# EAGLE schematic radar (EAGLE 7.1.0)
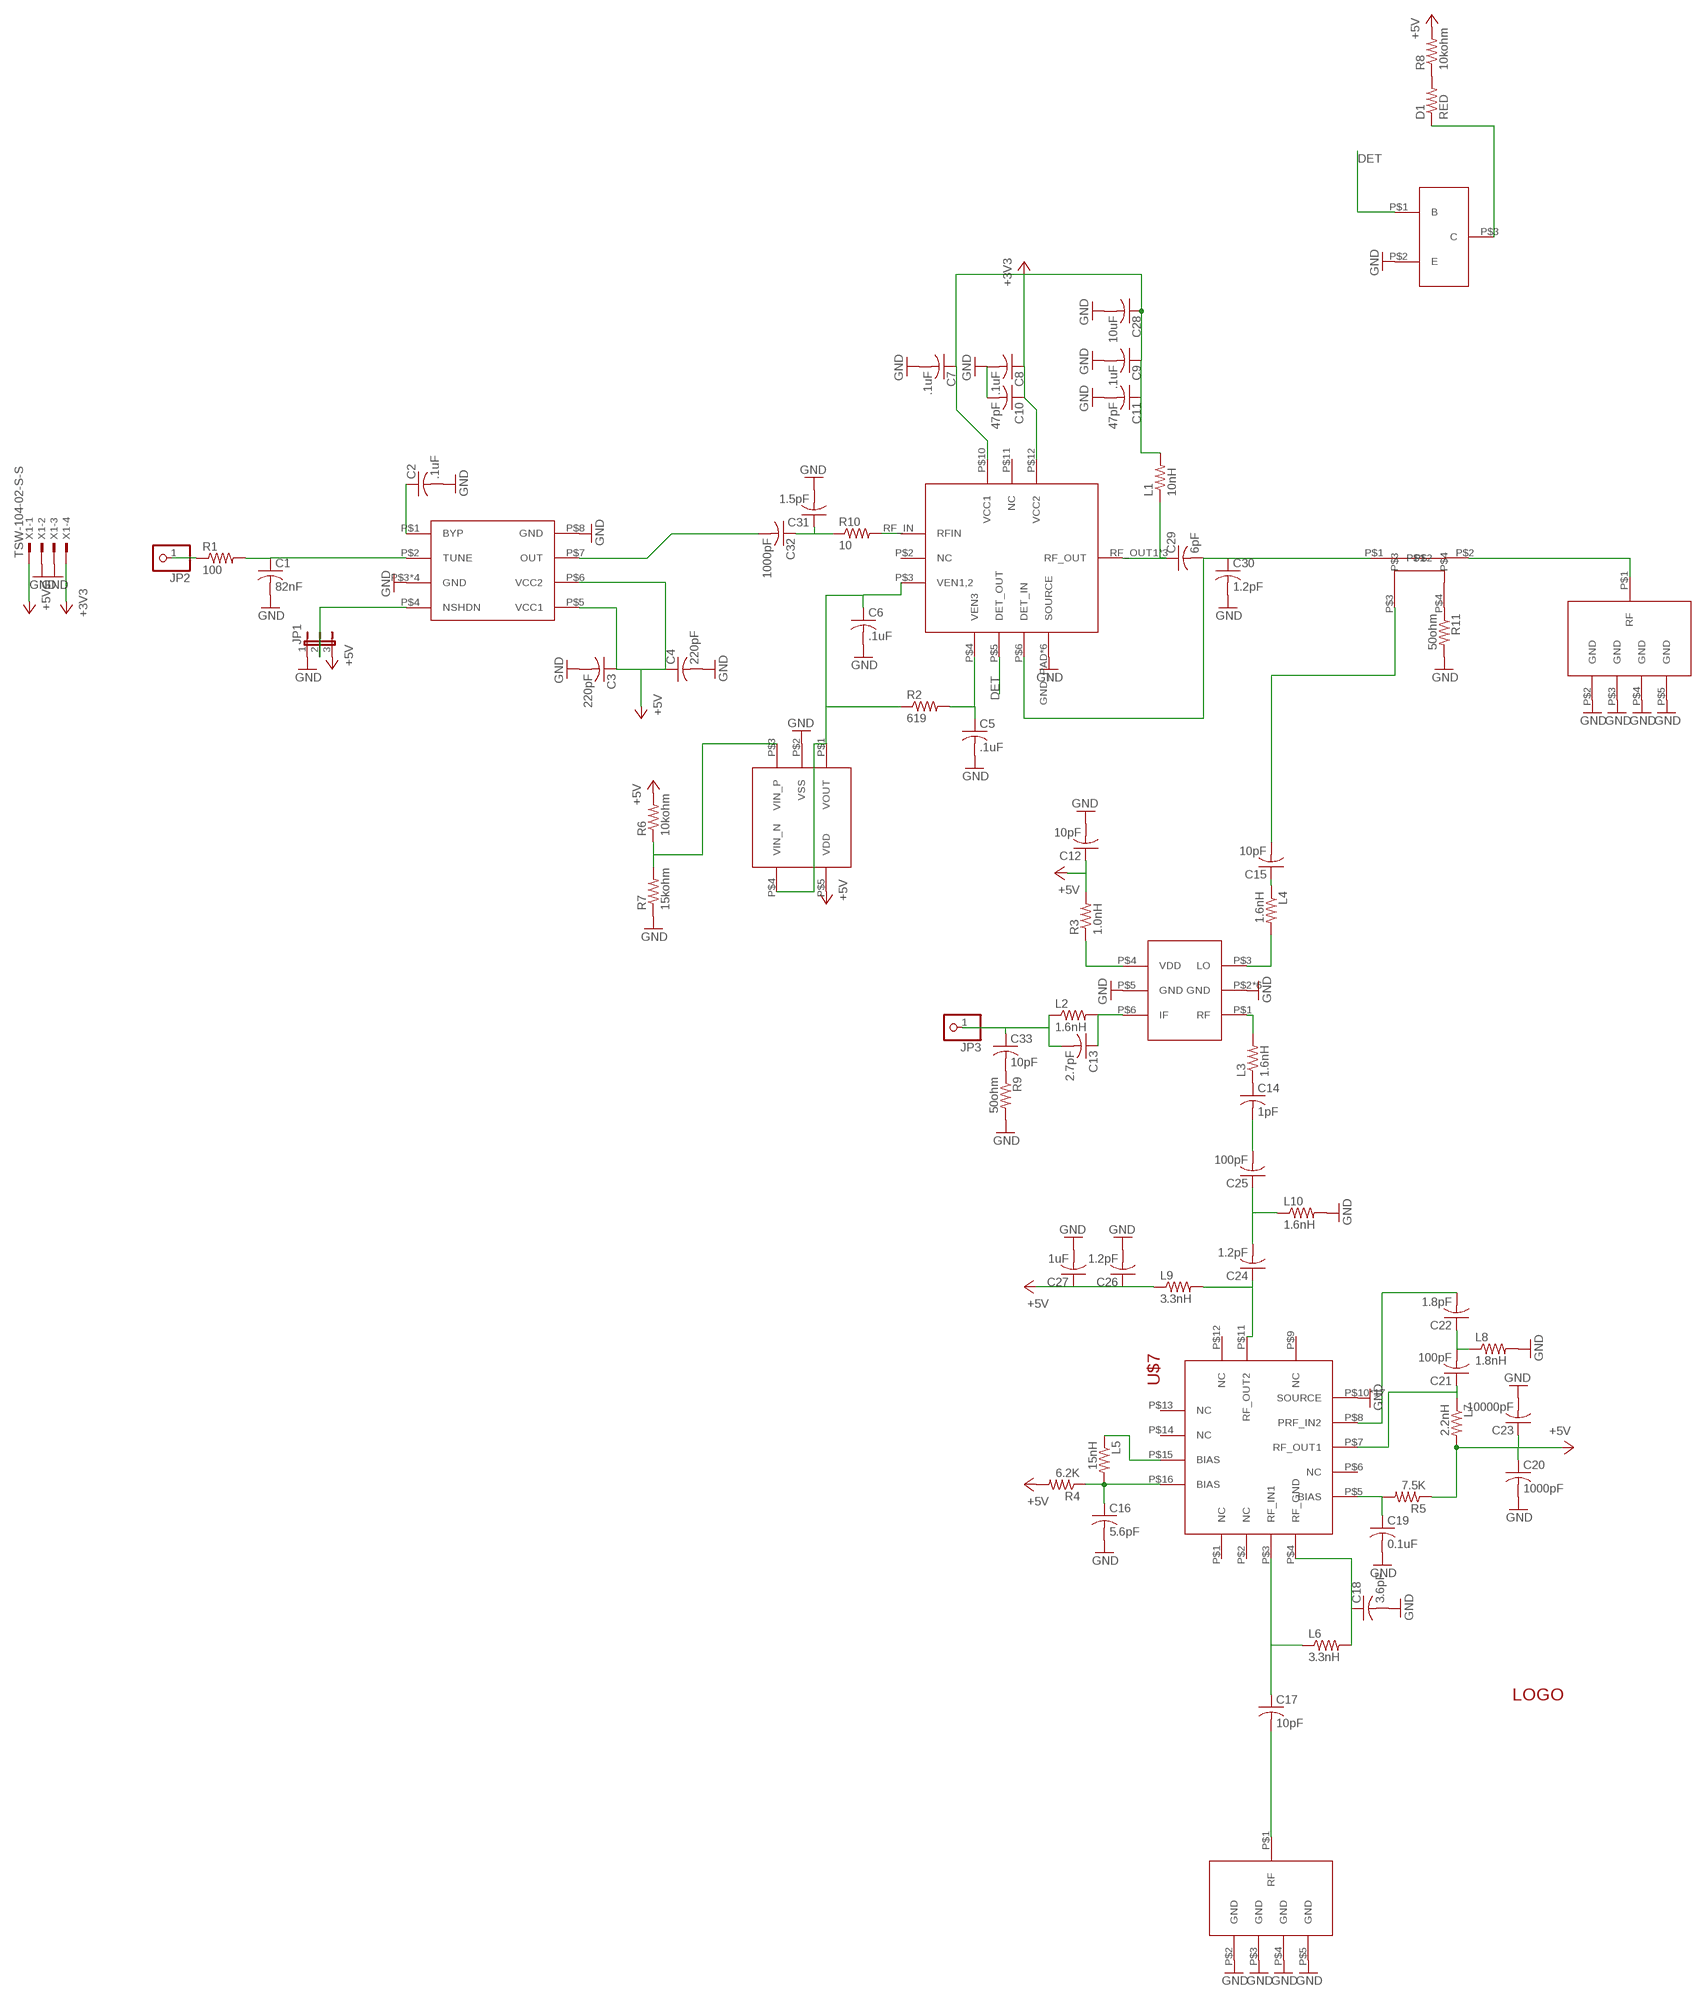
[diagram p0: schematic, sheet 1]

## Parts
C1  82nF  C-USC3216  [C3216]
C2  .1uF  C-USC0805  [C0805]
C3  220pF  C-USC0805  [C0805]
C4  220pF  C-USC0805  [C0805]
C5  .1uF  C-USC0805  [C0805]
C6  .1uF  C-USC0805  [C0805]
C7  .1uF  C-USC0805  [C0805]
C8  .1uF  C-USC0805  [C0805]
C9  .1uF  C-USC0805  [C0805]
C10  47pF  C-USC0805  [C0805]
C11  47pF  C-USC0805  [C0805]
C12  10pF  C-USC0805  [C0805]
C13  2.7pF  C-USC0603  [C0603]
C14  1pF  C-USC0603  [C0603]
C15  10pF  C-USC0603  [C0603]
C16  5.6pF  C-USC0603  [C0603]
C17  10pF  C-USC0603  [C0603]
C18  3.6pF  C-USC0603  [C0603]
C19  0.1uF  C-USC0603  [C0603]
C20  1000pF  C-USC0603  [C0603]
C21  100pF  C-USC0603  [C0603]
C22  1.8pF  C-USC0603  [C0603]
C23  10000pF  C-USC0603  [C0603]
C24  1.2pF  C-USC0603  [C0603]
C25  100pF  C-USC0603  [C0603]
C26  1.2pF  C-USC0603  [C0603]
C27  1uF  C-USC0603  [C0603]
C28  10uF  C-USC1206  [C1206]
C29  6pF  C-USC0603  [C0603]
C30  1.2pF  C-USC0603  [C0603]
C31  1.5pF  C-USC0603K  [C0603K]
C32  1000pF  C-USC0603K  [C0603K]
C33  10pF  C-USC0805  [C0805]
D1  RED  R-US_R1206  [R1206]
JP1  JP2E  [JP2]
JP2  PINHD-1X1  [1X01]
JP3  PINHD-1X1  [1X01]
L1  10nH  R-US_R0603  [R0603]
L2  1.6nH  R-US_R0603  [R0603]
L3  1.6nH  R-US_R0603  [R0603]
L4  1.6nH  R-US_R0603  [R0603]
L5  15nH  R-US_R0603  [R0603]
L6  3.3nH  R-US_R0603  [R0603]
L7  2.2nH  R-US_R0603  [R0603]
L8  1.8nH  R-US_R0603  [R0603]
L9  3.3nH  R-US_R0603  [R0603]
L10  1.6nH  R-US_R0603  [R0603]
R1  100  R-US_R1206  [R1206]
R2  619  R-US_R0805  [R0805]
R3  1.0nH  R-US_R0402  [R0402]
R4  6.2K  R-US_R0603  [R0603]
R5  7.5K  R-US_R0603  [R0603]
R6  10kohm  R-US_R1206  [R1206]
R7  15kohm  R-US_R1206  [R1206]
R8  10kohm  R-US_R1206  [R1206]
R9  50ohm  R-US_R0805  [R0805]
R10  10  R-US_R0603  [R0603]
R11  50ohm  R-US_R0805  [R0805]
U1  MAX2750  [MAX2750]
U$1  COUPLER  [COUPLER]
U$2  MAAPSS0075  [MAAPSS075]
U$3  CMY210  [CMY210]
U$4  SMA  [SMA]
U$6  SMA  [SMA]
U$7  SKY67107  [SKY67107]
U$9  MCP6001  [SOT-23-5]
U$10  MMBT3904  [SOT23-3]
U$11  LOGO  [LOGO]
X1  TSW-104-02-S-S  [TSW-104-02-S-S]

## Nets
+3V3: C7.1 C8.1 C9.1 C10.1 C11.1 C28.1 L1.2 U$2.P$10(VCC1) U$2.P$12(VCC2) X1.4
+5V: C3.1 C4.1 C12.1 C20.1 C23.1 C26.1 C27.1 JP1.3 L7.2 L9.1 R3.2 R4.2 R5.1 R6.2 R8.2 U1.P$5(VCC1) U1.P$6(VCC2) U$9.P$5(VDD) X1.1
DET: U$2.P$5(DET_OUT) U$10.P$1(B)
GND: C1.2 C2.2 C3.2 C4.2 C5.2 C6.2 C7.2 C8.2 C9.2 C10.2 C11.2 C12.2 C16.2 C18.2 C19.2 C20.2 C23.2 C26.2 C27.2 C28.2 C30.2 C31.2 JP1.1 L8.2 L10.2 R7.1 R9.2 R11.2 U1.P$3(GND) U1.P$8(GND) U1.P$9(GND) U1.P$11(GND) U1.P$13(GND) U$2.GND_PAD(SOURCE) U$2.P$1(SOURCE) U$2.P$7(SOURCE) U$2.P$8(SOURCE) U$2.P$9(SOURCE) U$2.P$14(SOURCE) U$3.P$2(GND) U$3.P$5(GND) U$3.P$7(GND) U$3.P$8(GND) U$3.P$9(GND) U$3.P$10(GND) U$3.P$11(GND) U$4.P$2(GND) U$4.P$3(GND) U$4.P$4(GND) U$4.P$5(GND) U$6.P$2(GND) U$6.P$3(GND) U$6.P$4(GND) U$6.P$5(GND) U$7.P$10(SOURCE) U$7.P$17(SOURCE) U$7.P$18(SOURCE) U$7.P$19(SOURCE) U$7.P$20(SOURCE) U$7.P$21(SOURCE) U$7.P$22(SOURCE) U$7.P$23(SOURCE) U$7.P$24(SOURCE) U$7.P$25(SOURCE) U$7.P$26(SOURCE) U$7.P$27(SOURCE) U$7.P$28(SOURCE) U$7.P$29(SOURCE) U$7.P$30(SOURCE) U$7.P$31(SOURCE) U$7.P$32(SOURCE) U$9.P$2(VSS) U$10.P$2(E) X1.2 X1.3
N$1: JP1.2 U1.P$4(NSHDN)
N$2: C1.1 R1.2 U1.P$2(TUNE)
N$3: JP2.1 R1.1
N$4: C2.1 U1.P$1(BYP)
N$5: C29.1 L1.1 U$2.RF_OUT1(RF_OUT) U$2.RF_OUT2(RF_OUT) U$2.RF_OUT3(RF_OUT)
N$6: C32.2 U1.P$7(OUT)
N$7: C6.1 R2.1 U$2.P$3(VEN1,2) U$9.P$1(VOUT) U$9.P$4(VIN_N)
N$8: C5.1 R2.2 U$2.P$4(VEN3)
N$9: C29.2 C30.1 U$1.P$1 U$2.P$6(DET_IN)
N$10: R3.1 U$3.P$4(VDD)
N$12: C15.2 U$1.P$3
N$13: C13.1 L2.2 U$3.P$6(IF)
N$14: C13.2 C33.1 JP3.1 L2.1
N$15: C14.1 L3.1
N$16: L3.2 U$3.P$1(RF)
N$17: L4.2 U$3.P$3(LO)
N$18: C15.1 L4.1
N$19: U$1.P$2 U$4.P$1(RF)
N$20: D1.2 R8.1
N$21: C16.1 L5.2 R4.1 U$7.P$16(BIAS)
N$22: L5.1 U$7.P$15(BIAS)
N$23: C17.1 L6.1 U$7.P$3(RF_IN1)
N$24: C18.1 L6.2 U$7.P$4(RF_GND)
N$25: C19.1 R5.2 U$7.P$5(BIAS)
N$26: C24.1 L9.2 U$7.P$11(RF_OUT2)
N$27: C22.2 U$7.P$8(PRF_IN2)
N$28: C21.2 C22.1 L8.1
N$29: C21.1 L7.1 U$7.P$7(RF_OUT1)
N$30: C24.2 C25.1 L10.1
N$31: C14.2 C25.2
N$32: C17.2 U$6.P$1(RF)
N$33: C31.1 C32.1 R10.1
N$34: R6.1 R7.2 U$9.P$3(VIN_P)
N$35: D1.1 U$10.P$3(C)
N$38: R10.2 U$2.RF_IN(RFIN)
N$40: C33.2 R9.1
N$41: R11.1 U$1.P$4
Unconnected: U$2.P$2(NC) U$2.P$11(NC) U$7.P$1(NC) U$7.P$2(NC) U$7.P$6(NC) U$7.P$9(NC) U$7.P$12(NC) U$7.P$13(NC) U$7.P$14(NC)

## Library data of the parts
C1 = resistor:C-US: CAPACITOR, American symbol; MANUFACTURER: Vishay; PART#: VJ1206Y823MXBTW1BC
C2 C5-C9 C29-C32 = rcl:C-US: CAPACITOR, American symbol; MANUFACTURER: Vishay; PART#: VJ0805Y104MXXAC
C3 C4 = rcl:C-US: CAPACITOR, American symbol; MANUFACTURER: Vishay; PART#: VJ0805A221JXAPW1BC
C10 C11 = rcl:C-US: CAPACITOR, American symbol; MANUFACTURER: Vishay; PART#: VJ0805A470GXACW1BC
C12 C17 = rcl:C-US: CAPACITOR, American symbol; MANUFACTURER: Vishay; PART#: VJ0603A100JXACW1BC
C13 C15 = rcl:C-US: CAPACITOR, American symbol; MANUFACTURER: Vishay; PART#: VJ0603A2R7CXACW1BC
C14 = rcl:C-US: CAPACITOR, American symbol; MANUFACTURER: Vishay; PART#: VJ0603A1R0CXACW1BC
C16 = rcl:C-US: CAPACITOR, American symbol; MANUFACTURER: Vishay; PART#: VJ0603A5R6CXACW1BC
C18-C27 = rcl:C-US: CAPACITOR, American symbol; MANUFACTURER: Vishay; PART#: VJ0603A3R9CXACW1BC
C28 = rcl:C-US: CAPACITOR, American symbol; MANUFACTURER: Vishay; PART#: VJ1206V106ZXQTW1BC
C33 = rcl:C-US: CAPACITOR, American symbol; MANUFACTURER: Vishay; PART#: VJ0805A100GXAPW1BC
D1 R1 R6-R8 = resistor:R-US_: RESISTOR, American symbol; MANUFACTURER: Vishay; PART#: VJ1206Y823MXBTW1BC
JP1 = jumper:JP2E: JUMPER
JP2 JP3 = pinhead:PINHD-1X1: PIN HEADER
L1 = resistor:R-US_: RESISTOR, American symbol; MANUFACTURER: Taiyo Yuden; PART#: HK060310NJ-T
L2-L4 L10 = resistor:R-US_: RESISTOR, American symbol; MANUFACTURER: TE Connectivity; PART#: HK060310NJ-T
L5 = resistor:R-US_: RESISTOR, American symbol; MANUFACTURER: Taiyo Yuden; PART#: HK160815NJ-T
L6-L9 = resistor:R-US_: RESISTOR, American symbol; MANUFACTURER: Taiyo Yuden; PART#: HK16083N3S-T
R2 R10 = resistor:R-US_: RESISTOR, American symbol; MANUFACTURER: Vishay; PART#: CRCW0805619RFKEA
R3 = resistor:R-US_: RESISTOR, American symbol; MANUFACTURER: Vishay; PART#: ILC0402ER1N0S
R4 R5 = resistor:R-US_: RESISTOR, American symbol; MANUFACTURER: Vishay; PART#: CRCW06036K20FKEA
R9 R11 = resistor:R-US_: RESISTOR, American symbol; MANUFACTURER: Vishay; PART#: CRCW080550R0FKTA
U1 = RADAR:MAX2750
U$1 = RADAR:COUPLER
U$2 = RADAR:MAAPSS0075
U$3 = RADAR:CMY210
U$4 U$6 = RADAR:SMA
U$7 = RADAR:SKY67107
U$9 = RADAR:MCP6001
U$10 = RADAR:MMBT3904
U$11 = RADAR:LOGO
X1 = con-samtec:TSW-104-02-S-S: THROUGH-HOLE .025" SQ POST HEADER Source: Samtec TSW.pdf; OC_FARNELL: unknown; OC_NEWARK: unknown